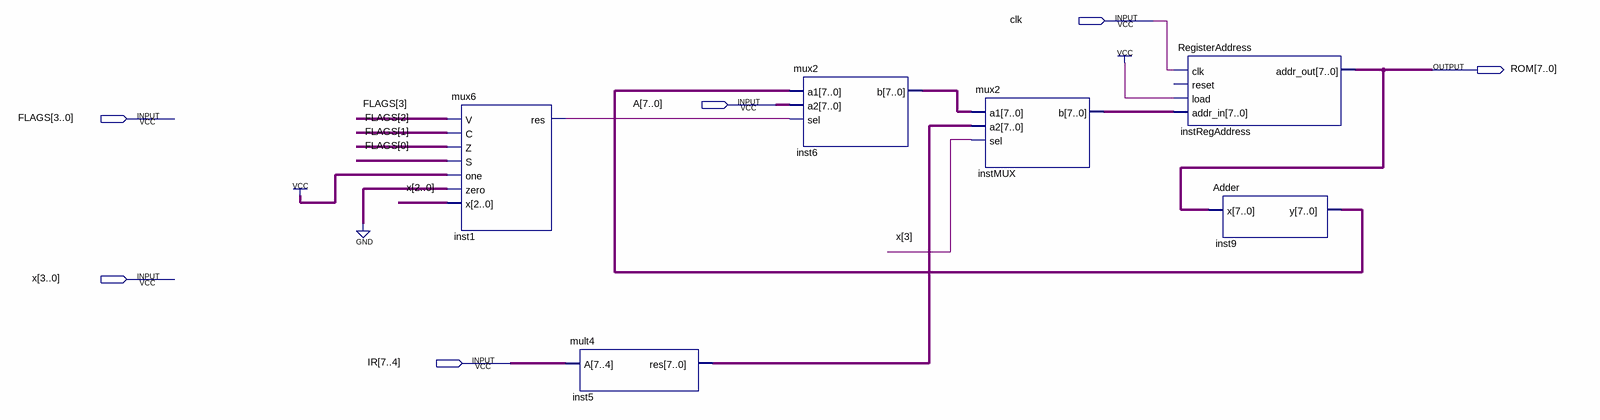
[diagram p0: schematic sheet]
// Quartus schematic uklad_sterujacy.bdf as structural Verilog: 6 symbols, 6 pins
module uklad_sterujacy (
  input  clk,
  input  [7:0] A,
  input  [3:0] FLAGS,
  input  [3:0] x,
  input  [7:4] IR,
  output [7:0] ROM
);

  wire inst1_res;
  wire [7:0] inst5_res, inst6_b, inst9_y, instMUX_b;

  mux6 inst1 (
    .V(FLAGS[3]), .C(FLAGS[2]), .Z(FLAGS[1]), .S(FLAGS[0]), .one(1'b1), .zero(1'b0), .x(x[2:0]),
    .res(inst1_res));
  mult4 inst5 (.A(IR), .res(inst5_res));
  mux2 inst6 (.a1(inst9_y), .a2(A), .sel(inst1_res), .b(inst6_b));
  mux2 instMUX (.a1(inst6_b), .a2(inst5_res), .sel(x[3]), .b(instMUX_b));
  RegisterAddress instRegAddress (.clk(clk), .load(1'b1), .addr_in(instMUX_b), .addr_out(ROM));  // open: reset
  Adder inst9 (.x(ROM), .y(inst9_y));
endmodule
